# EAGLE design tpa3136_breakout_board (EAGLE 9.6.2)
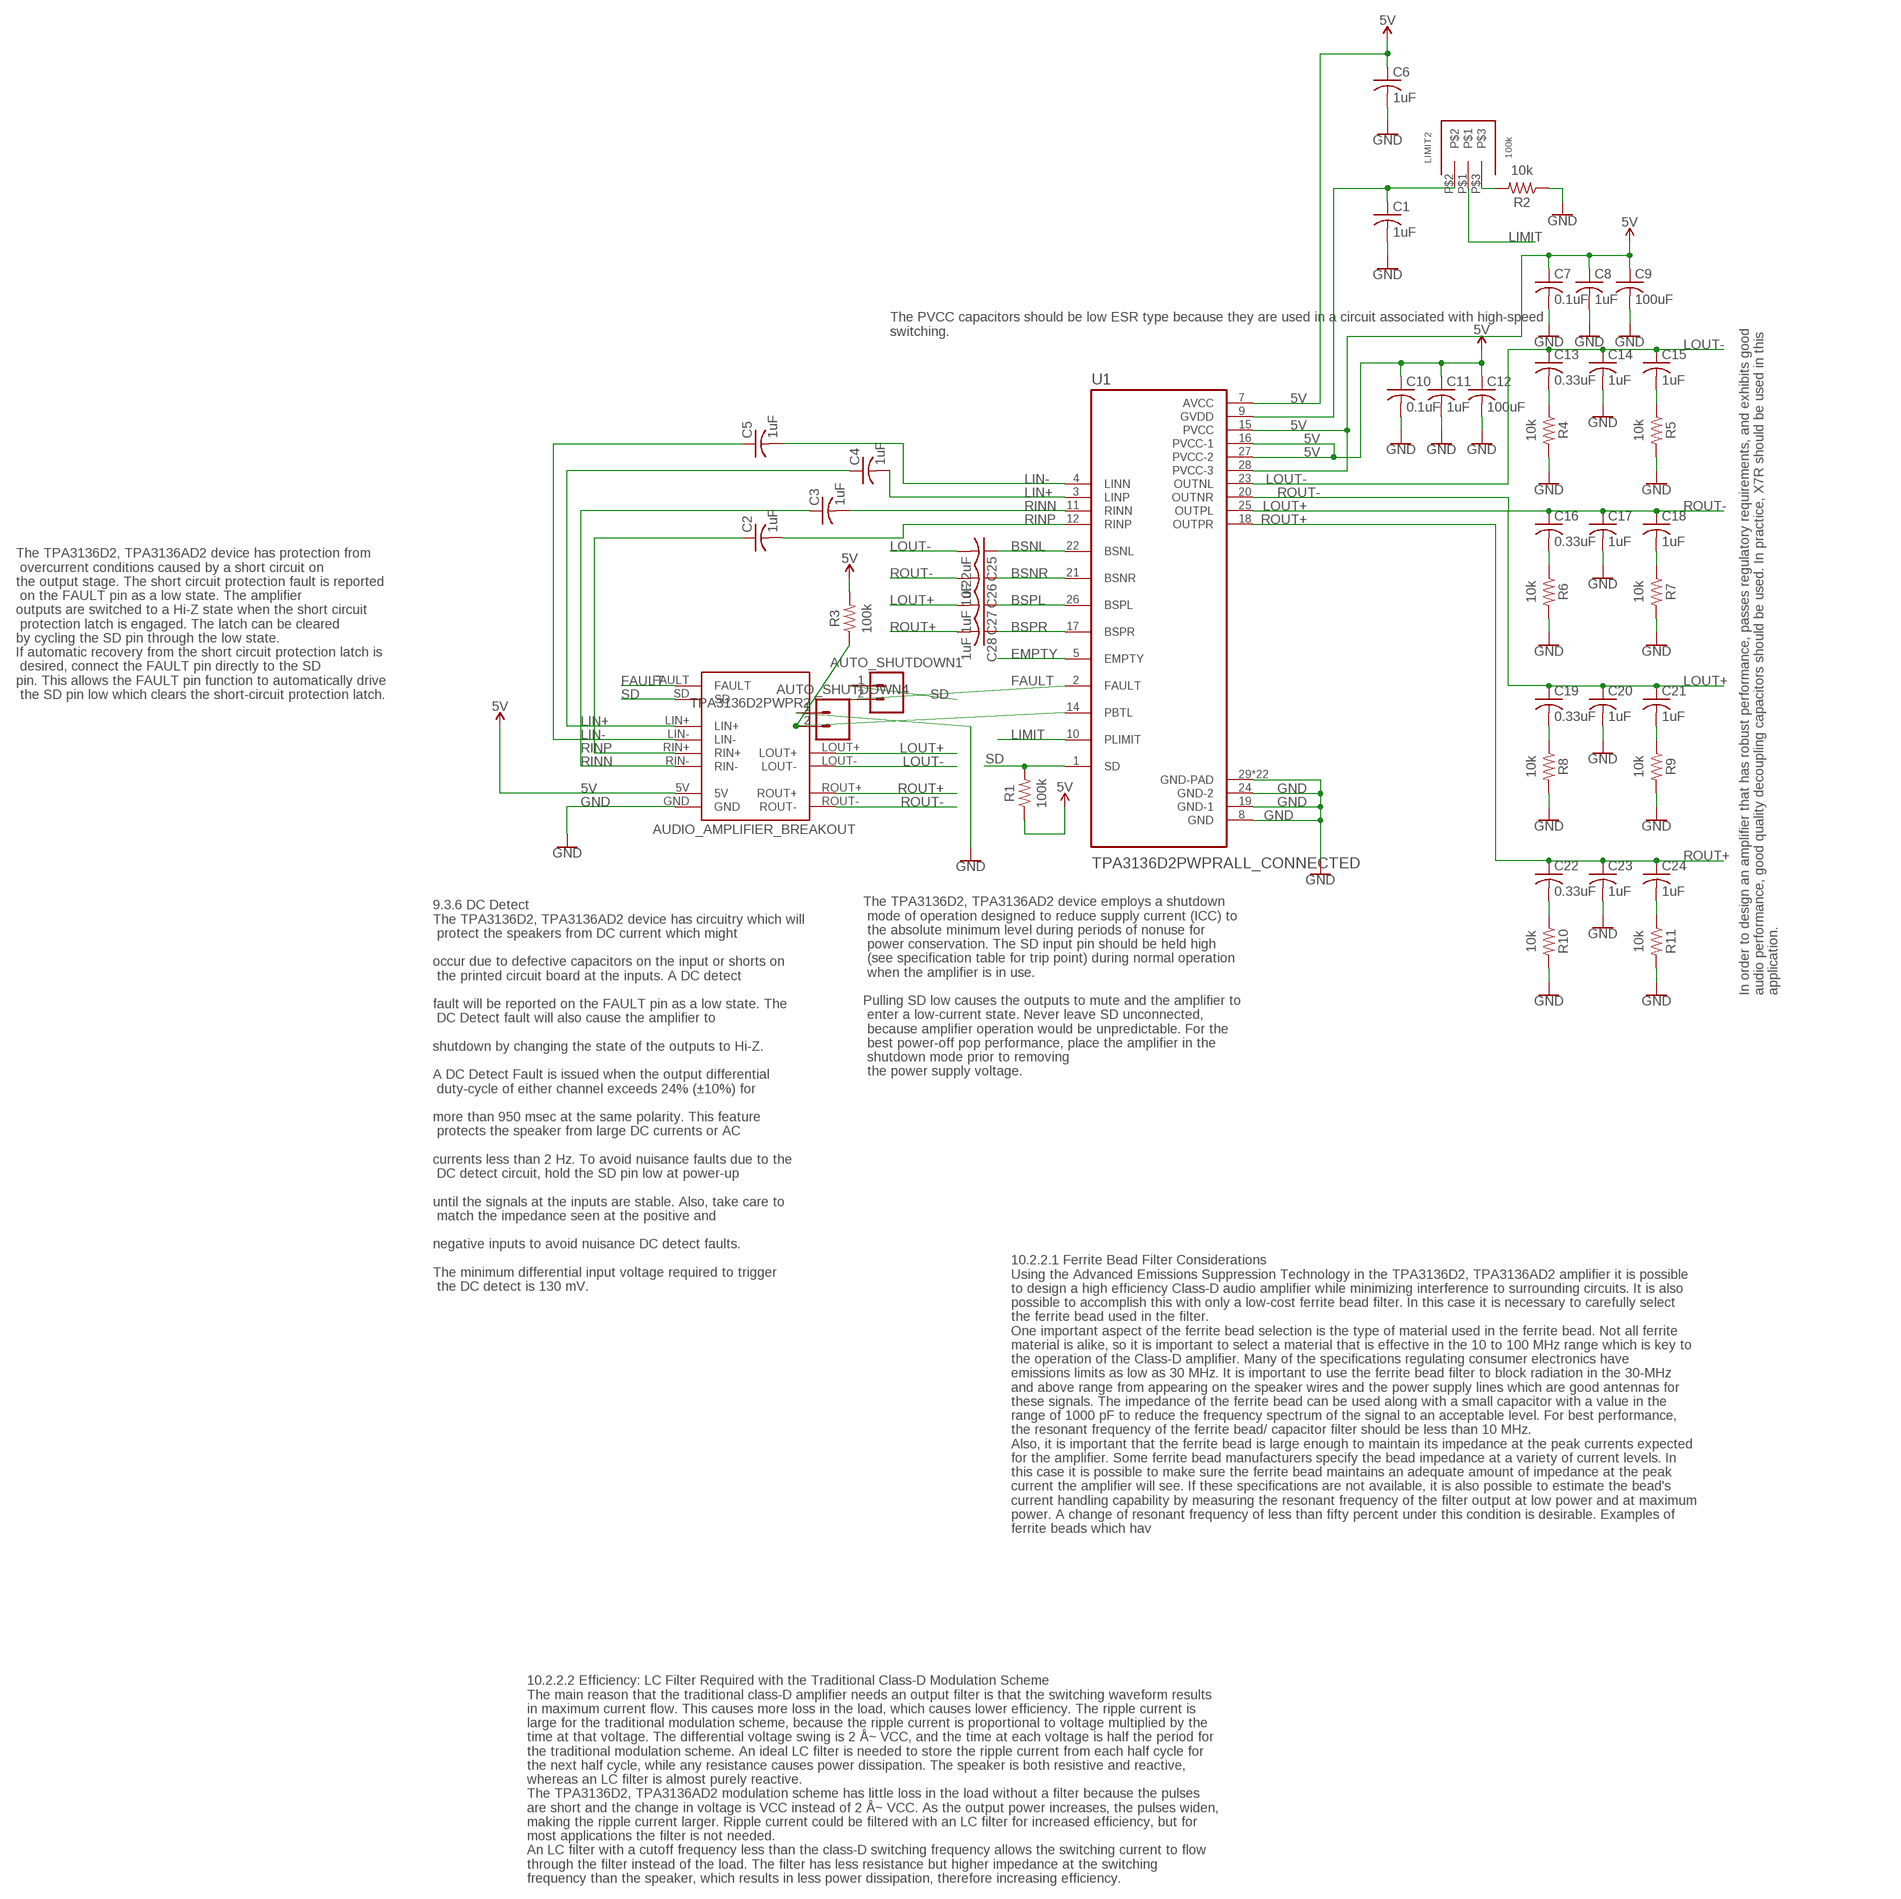
[diagram p0: schematic, sheet 1]

## Parts
AUTO_SHUTDOWN1  CONN_02  [1X02]
AUTO_SHUTDOWN4  CONN_02  [1X02]
C1  1uF  C-US_CHIP-0805(2012-METRIC)  [CAPC2012X110]
C2  1uF  C-US_CHIP-0805(2012-METRIC)  [CAPC2012X110]
C3  1uF  C-US_CHIP-0805(2012-METRIC)  [CAPC2012X110]
C4  1uF  C-US_CHIP-0805(2012-METRIC)  [CAPC2012X110]
C5  1uF  C-US_CHIP-0805(2012-METRIC)  [CAPC2012X110]
C6  1uF  C-US_CHIP-0805(2012-METRIC)  [CAPC2012X110]
C7  0.1uF  C-US_CHIP-0805(2012-METRIC)  [CAPC2012X110]
C8  1uF  C-US_CHIP-0805(2012-METRIC)  [CAPC2012X110]
C9  100uF  C-US_CHIP-1206(3216-METRIC)  [CAPC3216X135]
C10  0.1uF  C-US_CHIP-0805(2012-METRIC)  [CAPC2012X110]
C11  1uF  C-US_CHIP-0805(2012-METRIC)  [CAPC2012X110]
C12  100uF  C-US_CHIP-1206(3216-METRIC)  [CAPC3216X135]
C13  0.33uF  C-US_CHIP-0805(2012-METRIC)  [CAPC2012X110]
C14  1uF  C-US_CHIP-0805(2012-METRIC)  [CAPC2012X110]
C15  1uF  C-US_CHIP-0805(2012-METRIC)  [CAPC2012X110]
C16  0.33uF  C-US_CHIP-0805(2012-METRIC)  [CAPC2012X110]
C17  1uF  C-US_CHIP-0805(2012-METRIC)  [CAPC2012X110]
C18  1uF  C-US_CHIP-0805(2012-METRIC)  [CAPC2012X110]
C19  0.33uF  C-US_CHIP-0805(2012-METRIC)  [CAPC2012X110]
C20  1uF  C-US_CHIP-0805(2012-METRIC)  [CAPC2012X110]
C21  1uF  C-US_CHIP-0805(2012-METRIC)  [CAPC2012X110]
C22  0.33uF  C-US_CHIP-0805(2012-METRIC)  [CAPC2012X110]
C23  1uF  C-US_CHIP-0805(2012-METRIC)  [CAPC2012X110]
C24  1uF  C-US_CHIP-0805(2012-METRIC)  [CAPC2012X110]
C25  0.22uF  C-US_CHIP-0805(2012-METRIC)  [CAPC2012X110]
C26  1uF  C-US_CHIP-0805(2012-METRIC)  [CAPC2012X110]
C27  1uF  C-US_CHIP-0805(2012-METRIC)  [CAPC2012X110]
C28  1uF  C-US_CHIP-0805(2012-METRIC)  [CAPC2012X110]
LIMIT2  100k  3362_BOURNS_TRIMPOT  [3362_BOURNS_TRIMPOT]
R1  100k  R-US_CHIP-0805(2012-METRIC)  [RESC2012X65]
R2  10k  R-US_CHIP-0805(2012-METRIC)  [RESC2012X65]
R3  100k  R-US_CHIP-0805(2012-METRIC)  [RESC2012X65]
R4  10k  R-US_CHIP-0805(2012-METRIC)  [RESC2012X65]
R5  10k  R-US_CHIP-0805(2012-METRIC)  [RESC2012X65]
R6  10k  R-US_CHIP-0805(2012-METRIC)  [RESC2012X65]
R7  10k  R-US_CHIP-0805(2012-METRIC)  [RESC2012X65]
R8  10k  R-US_CHIP-0805(2012-METRIC)  [RESC2012X65]
R9  10k  R-US_CHIP-0805(2012-METRIC)  [RESC2012X65]
R10  10k  R-US_CHIP-0805(2012-METRIC)  [RESC2012X65]
R11  10k  R-US_CHIP-0805(2012-METRIC)  [RESC2012X65]
TPA3136D2PWPR2  AUDIO_AMPLIFIER_BREAKOUT  [AUDIO_AMPLIFIER_BREAKOUT]
U1  TPA3136D2PWPRALL_CONNECTED  [IC_TPS61196PWPRQ1]

## Nets
5V: C6.1 C7.1 C8.1 C9.1 C10.1 C11.1 C12.1 R1.1 R3.2 TPA3136D2PWPR2.5V U1.7(AVCC) U1.15(PVCC) U1.16(PVCC-1) U1.27(PVCC-2) U1.28(PVCC-3)
ASDFSDF: AUTO_SHUTDOWN4.1 ; supply symbol labelled GND
BSNL: C25.1 U1.22(BSNL)
BSNR: C26.1 U1.21(BSNR)
BSPL: C27.1 U1.26(BSPL)
BSPR: C28.1 U1.17(BSPR)
EMPTY: U1.5(EMPTY)
FAULT: AUTO_SHUTDOWN1.2 TPA3136D2PWPR2.FAULT U1.2(FAULT)
GND: C1.2 C6.2 C7.2 C8.2 C9.2 C10.2 C11.2 C12.2 C14.2 C17.2 C20.2 C23.2 R2.1 R4.2 R5.2 R6.2 R7.2 R8.2 R9.2 R10.2 R11.2 TPA3136D2PWPR2.GND U1.8(GND) U1.19(GND-1) U1.24(GND-2) U1.29(GND-PAD) U1.30(GND-PAD) U1.31(GND-PAD) U1.32(GND-PAD) U1.33(GND-PAD) U1.34(GND-PAD) U1.35(GND-PAD) U1.36(GND-PAD) U1.37(GND-PAD) U1.38(GND-PAD) U1.39(GND-PAD) U1.40(GND-PAD) U1.41(GND-PAD) U1.42(GND-PAD) U1.43(GND-PAD) U1.44(GND-PAD) U1.45(GND-PAD) U1.46(GND-PAD) U1.47(GND-PAD) U1.48(GND-PAD) U1.49(GND-PAD) U1.50(GND-PAD)
LIMIT: LIMIT2.P$1 U1.10(PLIMIT)
LIN+: C4.1 TPA3136D2PWPR2.LIN+
LIN-: C5.1 TPA3136D2PWPR2.LIN-
LOUT+: C19.1 C20.1 C21.1 C27.2 TPA3136D2PWPR2.LOUT+ U1.25(OUTPL)
LOUT-: C13.1 C14.1 C15.1 C25.2 TPA3136D2PWPR2.LOUT- U1.23(OUTNL)
N$1: C3.2 U1.11(RINN)
N$2: C2.2 U1.12(RINP)
N$3: C4.2 U1.3(LINP)
N$4: C5.2 U1.4(LINN)
N$5: C1.1 LIMIT2.P$2 U1.9(GVDD)
N$6: LIMIT2.P$3 R2.2
N$7: C13.2 R4.1
N$8: C15.2 R5.1
N$9: C16.2 R6.1
N$10: C18.2 R7.1
N$11: C19.2 R8.1
N$12: C21.2 R9.1
N$13: C22.2 R10.1
N$14: C24.2 R11.1
N$15: AUTO_SHUTDOWN4.2 R3.1 U1.14(PBTL)
RINN: C3.1 TPA3136D2PWPR2.RIN-
RINP: C2.1 TPA3136D2PWPR2.RIN+
ROUT+: C22.1 C23.1 C24.1 C28.2 TPA3136D2PWPR2.ROUT+ U1.18(OUTPR)
ROUT-: C16.1 C17.1 C18.1 C26.2 TPA3136D2PWPR2.ROUT- U1.20(OUTNR)
SD: AUTO_SHUTDOWN1.1 R1.2 TPA3136D2PWPR2.SD U1.1(SD)

## Notes on the sheet
- The PVCC capacitors should be low ESR type because they are used in a circuit associated with high-speed
  switching.
- The TPA3136D2, TPA3136AD2 device has protection from
   overcurrent conditions caused by a short circuit on
  the output stage. The short circuit protection fault is reported
   on the FAULT pin as a low state. The amplifier
  outputs are switched to a Hi-Z state when the short circuit
   protection latch is engaged. The latch can be cleared
  by cycling the SD pin through the low state.
  If automatic recovery from the short circuit protection latch is
   desired, connect the FAULT pin directly to the SD
  pin. This allows the FAULT pin function to automatically drive
   the SD pin low which clears the short-circuit protection latch.
- In order to design an amplifier that has robust performance, passes regulatory requirements, and exhibits good
  audio performance, good quality decoupling capacitors should be used. In practice, X7R should be used in this
  application.
- The TPA3136D2, TPA3136AD2 device employs a shutdown
   mode of operation designed to reduce supply current (ICC) to
   the absolute minimum level during periods of nonuse for
   power conservation. The SD input pin should be held high
   (see specification table for trip point) during normal operation
   when the amplifier is in use.
  
  Pulling SD low causes the outputs to mute and the amplifier to
   enter a low-current state. Never leave SD unconnected,
   because amplifier operation would be unpredictable. For the
   best power-off pop performance, place the amplifier in the
   shutdown mode prior to removing
   the power supply voltage.
- 9.3.6 DC Detect
  The TPA3136D2, TPA3136AD2 device has circuitry which will
   protect the speakers from DC current which might
  
  occur due to defective capacitors on the input or shorts on
   the printed circuit board at the inputs. A DC detect
  
  fault will be reported on the FAULT pin as a low state. The
   DC Detect fault will also cause the amplifier to
  
  shutdown by changing the state of the outputs to Hi-Z.
  
  A DC Detect Fault is issued when the output differential
   duty-cycle of either channel exceeds 24% (±10%) for
  
  more than 950 msec at the same polarity. This feature
   protects the speaker from large DC currents or AC
  
  currents less than 2 Hz. To avoid nuisance faults due to the
   DC detect circuit, hold the SD pin low at power-up
  
  until the signals at the inputs are stable. Also, take care to
   match the impedance seen at the positive and
  
  negative inputs to avoid nuisance DC detect faults.
  
  The minimum differential input voltage required to trigger
   the DC detect is 130 mV.
- 10.2.2.1 Ferrite Bead Filter Considerations
  Using the Advanced Emissions Suppression Technology in the TPA3136D2, TPA3136AD2 amplifier it is possible
  to design a high efficiency Class-D audio amplifier while minimizing interference to surrounding circuits. It is also
  possible to accomplish this with only a low-cost ferrite bead filter. In this case it is necessary to carefully select
  the ferrite bead used in the filter.
  One important aspect of the ferrite bead selection is the type of material used in the ferrite bead. Not all ferrite
  material is alike, so it is important to select a material that is effective in the 10 to 100 MHz range which is key to
  the operation of the Class-D amplifier. Many of the specifications regulating consumer electronics have
  emissions limits as low as 30 MHz. It is important to use the ferrite bead filter to block radiation in the 30-MHz
  and above range from appearing on the speaker wires and the power supply lines which are good antennas for
  these signals. The impedance of the ferrite bead can be used along with a small capacitor with a value in the
  range of 1000 pF to reduce the frequency spectrum of the signal to an acceptable level. For best performance,
  the resonant frequency of the ferrite bead/ capacitor filter should be less than 10 MHz.
  Also, it is important that the ferrite bead is large enough to maintain its impedance at the peak currents expected
  for the amplifier. Some ferrite bead manufacturers specify the bead impedance at a variety of current levels. In
  this case it is possible to make sure the ferrite bead maintains an adequate amount of impedance at the peak
  current the amplifier will see. If these specifications are not available, it is also possible to estimate the bead's
  current handling capability by measuring the resonant frequency of the filter output at low power and at maximum
  power. A change of resonant frequency of less than fifty percent under this condition is desirable. Examples of
  ferrite beads which have been tested and work well with the TPA3136D2, TPA3136AD2 device include
  NFZ2MSM series from Murata.
  A high quality ceramic capacitor is also needed for the ferrite bead filter. A low ESR capacitor with good
  temperature and voltage characteristics will work best.
  Additional EMC improvements may be obtained by adding snubber networks from each of the class-D outputs to
  ground. Suggested values for a simple RC series snubber network would be 68 Ω in series with a 100-pF
  capacitor although design of the snubber network is specific to every application and must be designed taking
  into account the parasitic reactance of the printed circuit board as well as the audio amp. Take care to evaluate
  the stress on the component in the snubber network especially if the amp is running at high PVCC. Also, make
  sure the layout of the snubber network is tight and returns directly to the GND or the thermal pad beneath the
  chip.
- 10.2.2.2 Efficiency: LC Filter Required with the Traditional Class-D Modulation Scheme
  The main reason that the traditional class-D amplifier needs an output filter is that the switching waveform results
  in maximum current flow. This causes more loss in the load, which causes lower efficiency. The ripple current is
  large for the traditional modulation scheme, because the ripple current is proportional to voltage multiplied by the
  time at that voltage. The differential voltage swing is 2 Å~ VCC, and the time at each voltage is half the period for
  the traditional modulation scheme. An ideal LC filter is needed to store the ripple current from each half cycle for
  the next half cycle, while any resistance causes power dissipation. The speaker is both resistive and reactive,
  whereas an LC filter is almost purely reactive.
  The TPA3136D2, TPA3136AD2 modulation scheme has little loss in the load without a filter because the pulses
  are short and the change in voltage is VCC instead of 2 Å~ VCC. As the output power increases, the pulses widen,
  making the ripple current larger. Ripple current could be filtered with an LC filter for increased efficiency, but for
  most applications the filter is not needed.
  An LC filter with a cutoff frequency less than the class-D switching frequency allows the switching current to flow
  through the filter instead of the load. The filter has less resistance but higher impedance at the switching
  frequency than the speaker, which results in less power dissipation, therefore increasing efficiency.

## Library data of the parts
AUTO_SHUTDOWN1 AUTO_SHUTDOWN4 = SparkFun-Connectors:CONN_02: Multi connection point. Often used as Generic Header-pin footprint for 0.1 inch spaced/style header connections On any of the 0.1 inch spaced packages, you can populate with these: Break Away Headers - Straight <https://www.sparkfun.com/products/116> (PRT-00116) Break Away Male Headers - Right Angle <https://www.sparkfun.com/products/553> (PRT-00553) Female Headers <https://www.sparkfun.com/products/115> (PRT-00115) Break Away Headers - Machine Pin <https://www.sparkfun.com/products/117> (PRT-00117) Break Away Female Headers - Swiss Machine Pin <https://www.sparkfun.com/products/743> (PRT-00743) For SCREWTERMINALS and SPRING TERMINALS visit here: Screw Terimnals on SparkFun.com <https://www.sparkfun.com/search/results?term=Screw+Terminals> (5mm/3.5mm/2.54mm spacing) This device is also useful as a general connection point to wire up your design to another part of your project. Our various solder wires solder well into these plated through hole pads. Hook-Up Wire - Assortment (Stranded, 22 AWG) <https://www.sparkfun.com/products/11375> (PRT-11375) Hook-Up Wire - Assortment (Solid Core, 22 AWG) <https://www.sparkfun.com/products/11367> (PRT-11367) View the entire wire category on our website here <https://www.sparkfun.com/categories/141> Special notes: Molex polarized connector foot print use with: PRT-08233 with associated crimp pins and housings. 2.54_SCREWTERM for use with PRT-10571. 3.5mm Screw Terminal footprints for PRT-08084 5mm Screw Terminal footprints for use with PRT-08432
C1-C28 = Capacitor:C-US: Capacitor - ANSI; CATEGORY: Capacitor
LIMIT2 = nathans-custom-parts:3362_BOURNS_TRIMPOT
R1-R11 = Resistor:R-US: Resistor Fixed - ANSI; CATEGORY: Resistor; SUB-CATEGORY: Fixed
TPA3136D2PWPR2 = nathans-custom-parts:AUDIO_AMPLIFIER_BREAKOUT
U1 = TPA3136D2PWPR:TPA3136D2PWPR: Check prices <https://pricing.snapeda.com/parts/TPA3136D2PWPR/Texas%20Instruments/view-part?ref=eda>

## Board
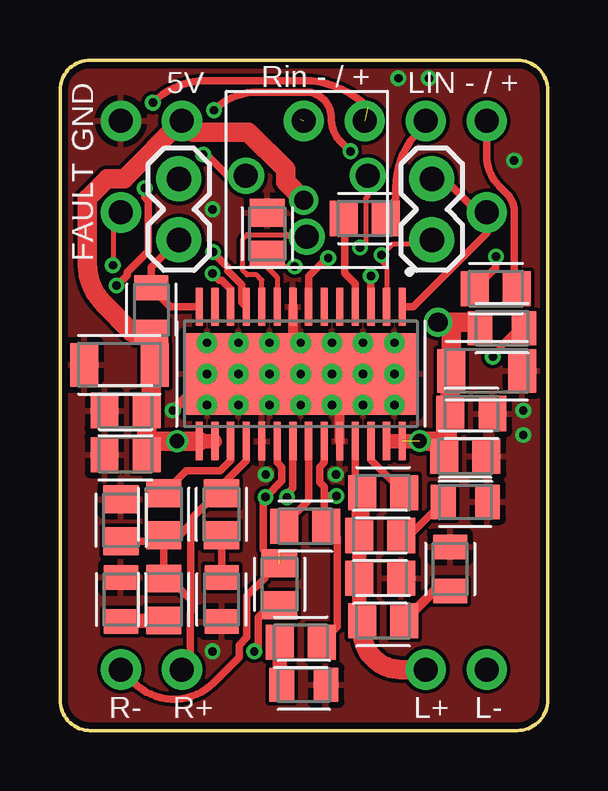
[diagram p1: board, top side]
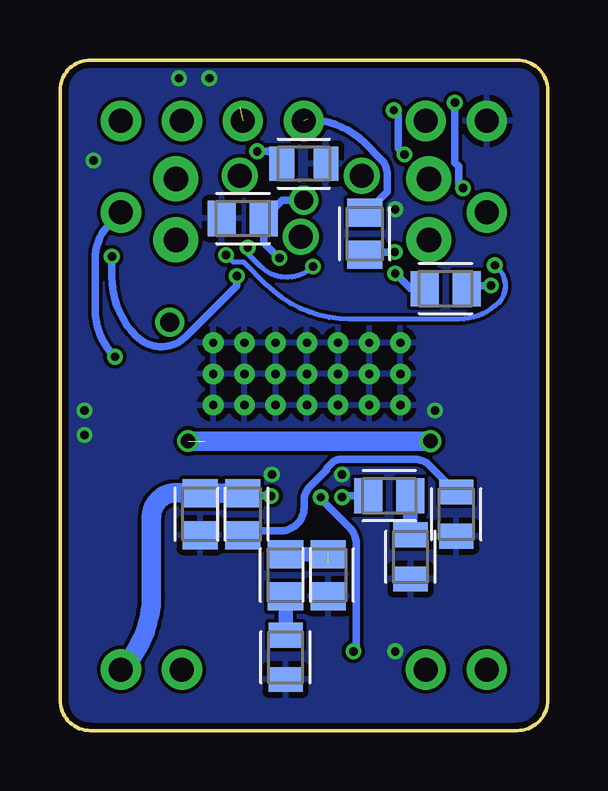
[diagram p2: board, bottom side, seen from below]

Size 20.32 x 27.94 mm. Coordinates in mm from the lower left corner, seen from the top.
Outline: 0,1.27 0,26.67 arc-90 1.27,27.94 19.05,27.94 arc-90 20.32,26.67 20.32,1.27 arc-90 19.05,0 1.27,0 arc-90 0,1.27
Copper layers (1*16): Top 0.035mm / dielectric 1.5mm / Bottom 0.035mm
Design rules "SeeedStudio_2layer_DRU_no_angle_20140221": minimum track width 6mil, minimum drill 12mil, track to track 6mil, track to pad 6mil, pad to pad 6mil, via to via 6mil, smd to smd 0mil, copper to edge 10mil, drill to drill 10mil, minimum pad ring 10mil, minimum via ring 6mil, stop-mask expansion 2mil, vias tented up to drill 100mil, thermal gap 10mil

### Footprints (pad centres in the part's own frame; a part is rotated, then mirrored left to right if it is on the bottom)
1X02 = drill 1.016 pad 1.88: 1 0,0; 2 2.54,0
CAPC2012X110 = smd 1.165 x 1.465: 1 -0.875,0; 2 0.875,0
CAPC3216X135 = smd 1.165 x 1.815: 1 -1.475,0; 2 1.475,0
3362_BOURNS_TRIMPOT = drill 1: P$1 0,2.54; P$2 -2.54,0; P$3 2.54,0
RESC2012X65 = smd 1.031 x 1.42: 1 -0.919,0; 2 0.919,0
AUDIO_AMPLIFIER_BREAKOUT = drill 1 pad 1.676: 5V -5.08,11.43; FAULT -7.62,7.62; GND -7.62,11.43; LIN+ 7.62,11.43; LIN- 5.08,11.43; LOUT+ 5.08,-11.43; LOUT- 7.62,-11.43; RIN+ 2.54,11.43; RIN- 0,11.43; ROUT+ -5.08,-11.43; ROUT- -7.62,-11.43; SD 7.62,7.62
IC_TPS61196PWPRQ1 = smd 1.6 x 0.3: 1 -2.8,4.225; 2 -2.8,3.575; 3 -2.8,2.925; 4 -2.8,2.275; 5 -2.8,1.625; 6 -2.8,0.975; 7 -2.8,0.325; 8 -2.8,-0.325; 9 -2.8,-0.975; 10 -2.8,-1.625; 11 -2.8,-2.275; 12 -2.8,-2.925; 13 -2.8,-3.575; 14 -2.8,-4.225; 15 2.8,-4.225; 16 2.8,-3.575; 17 2.8,-2.925; 18 2.8,-2.275; 19 2.8,-1.625; 20 2.8,-0.975; 21 2.8,-0.325; 22 2.8,0.325; 23 2.8,0.975; 24 2.8,1.625; 25 2.8,2.275; 26 2.8,2.925; 27 2.8,3.575; 28 2.8,4.225 | smd 3.4 x 9.7: 29 0,0 | drill 0.35 pad 0.5: 30 0,0; 31 0,1.3; 32 0,2.6; 33 0,3.9; 34 0,-1.3; 35 0,-2.6; 36 0,-3.9; 37 -1.3,3.9; 38 1.3,3.9; 39 -1.3,2.6; 40 1.3,2.6; 41 1.3,1.3; 42 -1.3,1.3; 43 -1.3,0; 44 1.3,0; 45 -1.3,-1.3; 46 1.3,-1.3; 47 -1.3,-2.6; 48 1.3,-2.6; 49 -1.3,-3.9; 50 1.3,-3.9

### Placement (x,y rotation side)
AUTO_SHUTDOWN1  15.49,22.99 270 top
AUTO_SHUTDOWN4  4.95,22.99 270 top
C1  8.64,20.7 90 top
C2  4.25,18.41 180 bottom
C3  7.62,20.7 270 bottom
C4  18.16,18.41 180 top
C5  12.7,21.34 180 top
C6  12.7,21.34 180 bottom
C7  16.89,11.43 0 top
C8  17.14,13.21 0 top
C9  17.78,14.99 0 top
C10  2.73,11.49 180 top
C11  2.73,13.34 180 top
C12  2.48,15.24 180 top
C13  10.03,3.68 180 top
C14  14.48,9.02 270 bottom
C15  12.7,9.02 270 bottom
C16  6.6,9.78 0 bottom
C17  9.14,6.48 270 bottom
C18  10.92,6.48 270 bottom
C19  13.34,8.13 0 top
C20  13.34,6.35 0 top
C21  13.46,4.57 0 top
C22  6.73,9.02 270 top
C23  2.54,8.76 90 top
C24  4.32,5.46 270 top
C25  10.22,8.51 0 top
C26  9.14,6.1 90 top
C27  13.46,9.91 180 top
C28  4.32,9.02 270 top
LIMIT2  10.29,23.11 180 top
R1  18.41,16.76 0 top
R2  10.16,23.62 180 bottom
R3  3.81,17.53 270 top
R4  10.16,1.91 0 top
R5  3.81,9.02 270 bottom
R6  5.71,7.24 270 bottom
R7  10.92,3.05 270 bottom
R8  16.89,9.53 0 top
R9  16.26,6.73 90 top
R10  6.73,5.46 270 top
R11  2.54,5.46 90 top
TPA3136D2PWPR2  10.16,13.97 0 top
U1  10.03,14.86 270 top

### Tracks (layer width: path | path; a pad name or v marks a point on that pad's centre or on a via)
5V  (via drill 0.35, 0.6, 0.8)  (1 unrouted)
  Top 0.305: U1.7 10.36,18.93 11.11,19.68 v11.18,19.68 | 13.84,12.06 U1.27
  Top 0.61: 13.84,12.06 U1.28 15.24,12.06 | U1.16 v4.88,12.06
  Top 0.813: 15.24,12.06 15.87,12.06 15.88,12.06 16.02,11.92 C7.1 16.14,11.56 16.14,13.08 C8.1 16.27,14.97 C9.1 16.3,16.76 16.05,17.02 v15.75,17.02 17.24,17.02 R1.1 | C11.1 3.8,13.53 3.8,15.22 C12.1 3.95,16.46 R3.2 3,16.61 1.83,17.78 arc-45 1.14,19.43 1.14,22.17 1.96,22.99 2.67,22.99 TPA3136D2PWPR2.5V 5.54,24.93 7.85,24.93 9.4,23.38 9.4,22.86 v10.16,22.1 | C11.1 C10.1 | U1.15 v4.88,12.06 3.61,12.06 C11.1
  Bottom 0.305: v11.18,19.68 11.82,20.33 C6.1 11.06,22.1 v10.16,22.1
  Bottom 0.813: v14.99,12.06 v4.89,12.06 v4.88,12.06
BSNL
  Top 0.305: U1.22 10.36,9.6 9.35,8.59 C25.1
BSNR  (via drill 0.35)
  Top 0.305: U1.21 9.71,10.1 9.46,9.85 v9.46,9.72 | v8.1,3.3 8.27,3.48 8.27,4.71 8.78,5.22 C26.1
  Bottom 0.305: v9.46,9.72 9.46,9.66 8.27,8.47 arc45 7.98,7.78 7.98,3.42 v8.1,3.3
BSPL
  Top 0.305: C27.1 12.96,11.29 U1.26
BSPR
  Top 0.305: U1.17 7.11,11.26 6.67,10.83 5.25,10.83 C28.1
FAULT  (via drill 0.35)
  Top 0.203: AUTO_SHUTDOWN1.2 15.3,20.26 13.84,20.26 v13.4,19.81 13.27,19.68 13.61,19.35 U1.2 | v2.2,19.39 2.22,19.39 2.22,21.27 TPA3136D2PWPR2.FAULT
  Bottom 0.203: v2.2,19.39 2.05,19.23 arc90 2.05,17.83 arc45 3.7,17.14 8.25,17.14 arc45 11.73,18.58 12.67,19.52 13.11,19.52 v13.4,19.81
GND  (via drill 0.35)
  Top 0.406: U1.8 9.71,16.48 U1.43 11.75,14.44 11.75,14.29 11.66,14.2 U1.24 | U1.36 5.38,15.61 5.38,16.19 6.72,14.86 U1.29 6.22,14.86 v4.7,13.34
  other vias: 6.35,21.72 18.92,23.75 19.3,13.34 19.3,12.32 11.49,10.67 8.57,10.67 6.35,3.3 14.1,27.18 15.37,27.18
  pour Top: 1.27,27.94 19.02,27.94 arc-90 20.32,26.64 20.32,1.27 arc-90 19.05,0 1.27,0 arc-90 0,1.27 0,26.67 arc-90
  pour Bottom: 1.3,27.94 19.05,27.94 arc-90 20.32,26.67 20.32,1.27 arc-90 19.05,0 1.27,0 arc-90 0,1.27 0,26.64 arc-90
LIMIT
  Top 0.203: U1.10 8.41,18.77 8.19,18.99 7.8,18.99 7.62,19.17 7.62,20.48 7.8,20.66 9.47,20.66 9.56,20.57 LIMIT2.P$1
LIN+
  Top 0.305: TPA3136D2PWPR2.LIN+ 17.78,23.94 arc45 18.3,22.68 18.63,22.35 arc-45 18.92,21.65 18.92,18.53 C4.1
LIN-
  Top 0.305: C5.1 13.57,21.69 13.99,22.11 13.99,22.62 arc-45 14.98,24.99 15.24,25.25 TPA3136D2PWPR2.LIN-
LOUT+
  Top 0.305: U1.25 12.31,8.28 C19.1
  Top 0.406: 12.46,4.7 C21.1
  Top 0.61: C27.2 12.59,8.26 C19.1 C20.1 12.46,4.7
  Top 0.813: TPA3136D2PWPR2.LOUT+ 14.21,2.54 arc-90 12.59,4.16 C21.1
LOUT-  (via drill 0.35)
  Top 0.305: 11.01,9.78 11.01,10.16 10.82,10.35 10.82,10.98 11.01,11.17 U1.23 | 11.01,9.78 11.01,8.6 C25.2 11.56,8.05 11.56,4.33 C13.1 | 11.01,9.78 v11.52,9.78
  Bottom 0.305: C15.1 12.59,9.78 v11.52,9.78
  Bottom 0.813: TPA3136D2PWPR2.LOUT- arc-45 16.51,5.61 16.51,8.89 arc90 15.49,9.91 14.49,9.91 C14.1 C15.1
N$1  (via drill 0.35)
  Top 0.305: U1.11 7.57,17.85 7.57,18.58 6.98,19.17 6.98,19.31 6.37,19.92 v6.37,19.94
  Bottom 0.305: v6.37,19.94 7.51,19.94 C3.2
N$2  (via drill 0.35)
  Top 0.305: v6.35,19.05 6.64,18.76 6.73,18.76 7.11,18.39 U1.12
  Bottom 0.305: v6.35,19.05 5.71,18.41 C2.2
N$3  (via drill 0.35)
  Top 0.305: C4.2 18.16,19.29 v18.16,19.75 | U1.3 v12.95,18.94
  Bottom 0.305: v18.16,19.75 18.16,18.9 arc-45 17.14,16.43 arc-90 15.06,16.43 12.95,18.54 v12.95,18.94
N$4
  Top 0.305: U1.4 12.31,18.61 11.86,19.06 11.86,21.02 11.69,21.2 C5.2
N$5  (via drill 0.35)
  Top 0.203: U1.9 9.06,18.88 8.64,19.3 C1.1 9.12,19.34 v9.78,19.34 | LIMIT2.P$2 12.83,22.26 12.74,22.17 12.74,20.37 v12.5,20.12
  Bottom 0.203: v12.5,20.12 12.5,19.87 11.97,19.34 arc-90 v9.78,19.34
N$6  (via drill 0.35)
  Top 0.305: v12.1,24.13 11.72,24.51 arc-45 11.3,25.53 arc90 10.22,26.61 8.25,26.61 arc45 v6.41,25.84 | v5.97,24 6.1,24 6.99,23.11 LIMIT2.P$3
  Bottom 0.305: R2.2 11.59,24.13 v12.1,24.13 | v6.41,25.84 6.23,25.66 6.23,24.27 v5.97,24
N$7
  Top 0.61: C13.2 9.16,1.99 R4.1
N$8
  Bottom 0.305: C15.2 12.3,8.14 12.13,8.32 11.13,8.32 arc-90 10.15,9.3 10.15,9.56 arc45 9.9,10.17 9.21,10.87 9.21,10.93 8.97,11.16 arc45 8.64,11.3 5.52,11.3 arc45 4.93,11.06 R5.1
N$9
  Bottom 0.61: C16.2 5.73,8.17 R6.1
N$10
  Bottom 0.61: R7.1 C18.2
N$11
  Top 0.305: R8.1 14.57,8.13 C19.2
N$12
  Top 0.406: R9.1 15.58,5.81 C21.2
N$13
  Top 0.305: C22.2 R10.1
N$14
  Top 0.61: R11.1 2.58,4.59 C24.2
N$15
  Top 0.305: AUTO_SHUTDOWN4.2 3.81,19.3 R3.1 4.6,17.66 U1.14
RINN  (1 unrouted)
  Bottom 0.305: C3.1 7.57,21.58 6.68,22.46 arc45 6.69,22.48 6.69,23.16 arc-45 6.97,23.83 7.61,24.47 arc-45 10,25.46
RINP  (via drill 0.35)  (1 unrouted)
  Top 0.305: 12.82,25.97 arc45 10.14,27.08 6.09,27.08 arc45 v3.87,26.16 | v3.53,22.6 3.53,22.21 3.68,22.06 3.68,19.98 2.79,19.09 2.79,18.98 v2.36,18.54
  Bottom 0.305: C2.1 3.38,18.54 v2.36,18.54 | v3.87,26.16 3.87,23.66 3.71,23.5 3.71,22.77 v3.53,22.6
ROUT+
  Top 0.305: U1.18 7.76,11.25 6.73,10.22 C22.1 6.54,9.89 5.45,8.81 5.45,8.62 | 5.45,8.62 4.98,8.14 C28.2 | C28.2 4.06,7.89 C23.1 | C28.2 C24.1 4.57,6.34 5.45,5.45 | TPA3136D2PWPR2.ROUT+ 5.29,2.54 5.42,2.67 5.42,4.89 5.45,4.92 5.45,5.45 | 5.45,5.45 5.45,8.62
ROUT-  (via drill 0.35)  (1 unrouted)
  Top 0.305: U1.20 9.06,11.17 9.25,10.98 9.25,10.41 v8.56,9.72 8.46,9.62 8.46,7.53 8.52,7.46 | TPA3136D2PWPR2.ROUT- 3.09,1.99 arc90 6.4,1.99 7.46,3.05 7.46,3.56 7.79,3.89 7.79,5.61 8.52,6.35 8.52,7.46 | C26.2 9.02,6.97 8.52,7.46
  Bottom 0.305: C16.1 8.51,9.78 v8.56,9.72
  Bottom 0.61: C17.1 C18.1
SD  (via drill 0.35)
  Top 0.305: AUTO_SHUTDOWN1.1 16,22.99 17.4,21.59 TPA3136D2PWPR2.SD 17.78,20.72 14.72,17.66 U1.1 | v18.03,15.57 18.37,15.91 18.37,16.02 19.11,16.76 R1.2
  Bottom 0.305: TPA3136D2PWPR2.SD 18.23,21.14 arc-45 18.86,19.63 18.86,17.57 arc-45 v18.03,15.57

### Text on the board
tPlace: 5V | Rin - / + | LIN - / + | GND | FAULT | R- | R+ | L+ | L-